# EAGLE schematic Node 1 (EAGLE 7.7.0)
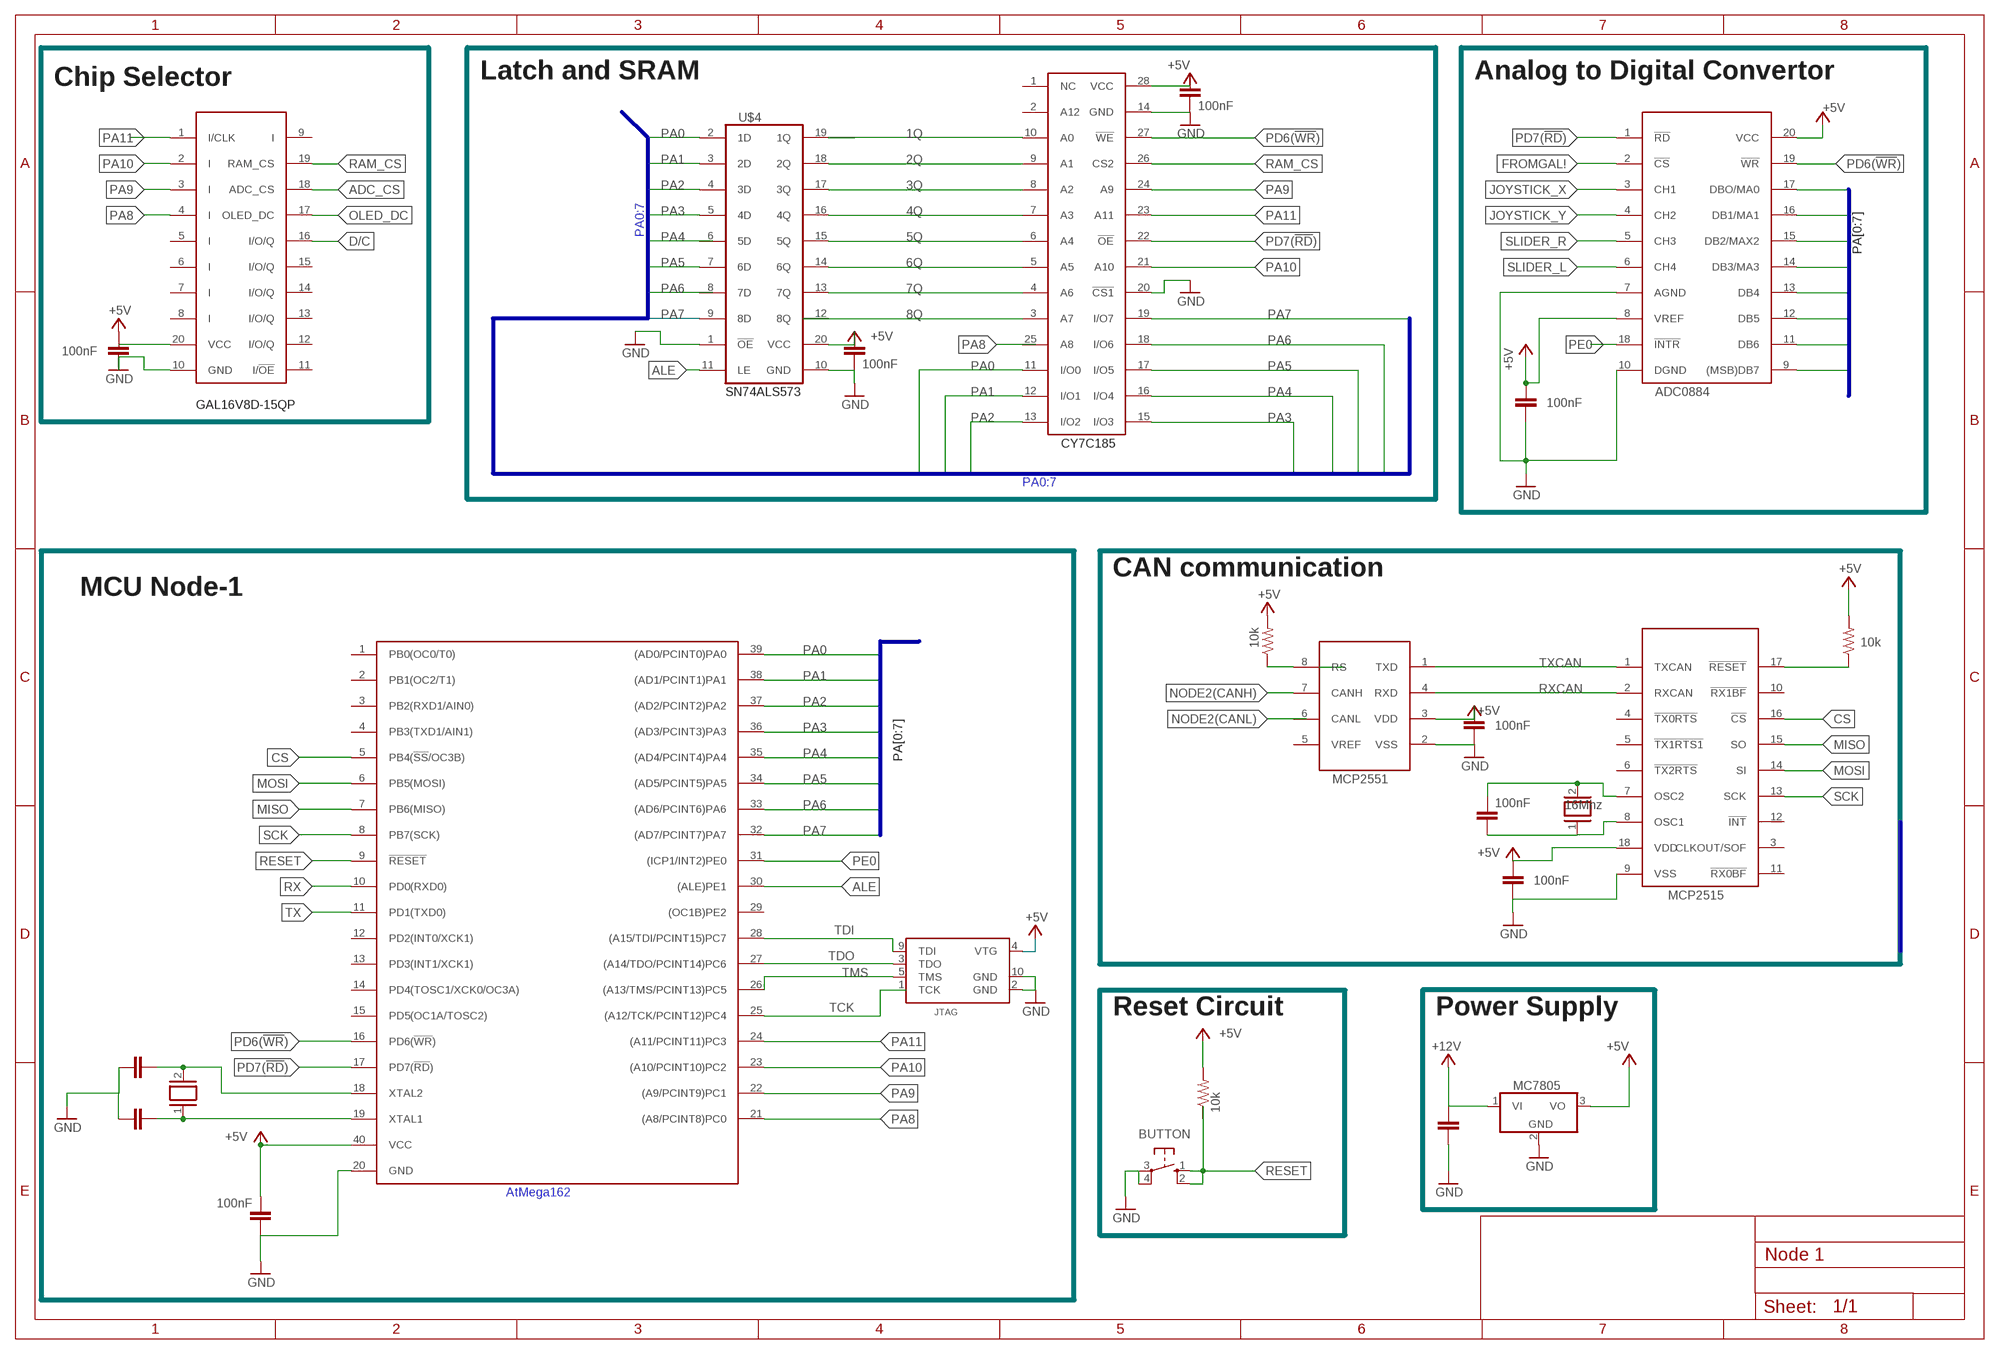
[diagram p0: schematic, sheet 1]

## Parts
ADC1  ADC0884  [DIP]
BUTTON  10-XX  [B3F-10XX]
C1  C-EU025-024X044  [C025-024X044]
C4  100nF  C-EU025-024X044  [C025-024X044]
C5  0  C-EUC1206  [C1206]
C6  0  C-EUC1206  [C1206]
C7  100nF  C-EU025-024X044  [C025-024X044]
C8  100nF  C-EU025-024X044  [C025-024X044]
C9  100nF  C-EU025-024X044  [C025-024X044]
C10  100nF  C-EU025-024X044  [C025-024X044]
C11  100nF  C-EU025-024X044  [C025-024X044]
C12  100nF  C-EU025-024X044  [C025-024X044]
C13  100nF  C-EU025-024X044  [C025-024X044]
Q1  4.9Mhz  XTAL/S  [QS]
Q2  16Mhz  XTAL/S  [QS]
R1  10k  R-US_0204/2V  [0204V]
R2  10k  R-US_0204/2V  [0204V]
R3  10k  R-US_0204/2V  [0204V]
U$1  ATMEGA162  [PDIP40]
U$2  MC7805  [MC7805]
U$3  JTAG  [DIP]
U$4  D-LATCH  [D-LATCH-20]
U$5  MCP2515  [MCP2515]
U$6  MCP2551  [MCP2551]
U$7  GAL  [DIP]
U$8  SRAM  [SRAM28]

## Nets
1Q: U$4.19(1Q) U$8.10(A0)
2Q: U$4.18(2Q) U$8.9(A1)
3Q: U$4.17(3Q) U$8.8(A2)
4Q: U$4.16(4Q) U$8.7(A3)
5Q: U$4.15(5Q) U$8.6(A4)
6Q: U$4.14(6Q) U$8.5(A5)
7Q: U$4.13(7Q) U$8.4(A6)
8Q: U$4.12(8Q) U$8.3(A7)
+5V: ADC1.8(VREF) ADC1.20(VCC) C1.1 C4.1 C7.1 C8.1 C9.1 C10.1 C11.1 R1.2 R2.2 R3.2 U$1.40(VCC) U$2.1(VI) U$2.3(VO) U$4.20(VCC) U$5.18(VDD) U$8.28(VCC) ; supply symbol labelled +12V
ADC_CS: U$7.18(ADC_CS)
ALE: U$1.30((ALE)PE1) U$4.11(LE)
CS: U$1.5(PB4(!SS!/OC3B)) U$5.16(!CS!)
D/C: U$7.16(I/O/Q)
FROMGAL!: ADC1.2(!CS!)
GND: ADC1.7(AGND) ADC1.10(DGND) BUTTON.3(P) BUTTON.4(P1) C1.2 C4.2 C5.1 C6.1 C7.2 C8.2 C9.2 C10.2 C11.2 C13.2 U$1.20(GND) U$2.2(GND) U$3.2(GND) U$3.10(GND) U$4.1(!OE!) U$4.10(GND) U$5.9(VSS) U$6.2(VSS) U$7.10(GND) U$8.14(GND) U$8.20(!CS1!)
JOYSTICK_X: ADC1.3(CH1)
JOYSTICK_Y: ADC1.4(CH2)
MISO: U$1.7(PB6(MISO)) U$5.15(SO)
MOSI: U$1.6(PB5(MOSI)) U$5.14(SI)
N$1: R3.1 U$5.17(!RESET!)
N$2: C5.2 Q1.2 U$1.18(XTAL2)
N$3: C6.2 Q1.1 U$1.19(XTAL1)
N$4: U$6.3(VDD)
N$6: C12.1 Q2.2 U$5.7(OSC2)
N$7: U$7.20(VCC)
N$8: C12.2 Q2.1 U$5.8(OSC1)
NODE2(CANH): U$6.7(CANH)
NODE2(CANL): U$6.6(CANL)
OLED_DC: U$7.17(OLED_DC)
PA0: ADC1.17(DBO/MA0) U$1.39((AD0/PCINT0)PA0) U$4.2(1D) U$8.11(I/O0)
PA1: ADC1.16(DB1/MA1) U$1.38((AD1/PCINT1)PA1) U$4.3(2D) U$8.12(I/O1)
PA2: ADC1.15(DB2/MAX2) U$1.37((AD2/PCINT2)PA2) U$4.4(3D) U$8.13(I/O2)
PA3: ADC1.14(DB3/MA3) U$1.36((AD3/PCINT3)PA3) U$4.5(4D) U$8.15(I/O3)
PA4: ADC1.13(DB4) U$1.35((AD4/PCINT4)PA4) U$4.6(5D) U$8.16(I/O4)
PA5: ADC1.12(DB5) U$1.34((AD5/PCINT5)PA5) U$4.7(6D) U$8.17(I/O5)
PA6: ADC1.11(DB6) U$1.33((AD6/PCINT6)PA6) U$4.8(7D) U$8.18(I/O6)
PA7: ADC1.9((MSB)DB7) U$1.32((AD7/PCINT7)PA7) U$8.19(I/O7)
PA8: U$1.21((A8/PCINT8)PC0) U$7.4(I) U$8.25(A8)
PA9: U$1.22((A9/PCINT9)PC1) U$7.3(I) U$8.24(A9)
PA10: U$1.23((A10/PCINT10)PC2) U$7.2(I) U$8.21(A10)
PA11: U$1.24((A11/PCINT11)PC3) U$7.1(I/CLK) U$8.23(A11)
PD6(!WR!): ADC1.19(!WR!) U$1.16(PD6(!WR!)) U$8.27(!WE!)
PD7(!RD!): ADC1.1(!RD!) U$1.17(PD7(!RD!)) U$8.22(!OE!)
PE0: ADC1.18(!INTR!) U$1.31((ICP1/INT2)PE0)
RAM_CS: U$7.19(RAM_CS) U$8.26(CS2)
RESET: BUTTON.1(S) BUTTON.2(S1) R1.1 U$1.9(!RESET!)
RESET1: R2.1 U$6.8(RS)
RX: U$1.10(PD0(RXD0))
RXCAN: U$5.2(RXCAN) U$6.4(RXD)
SCK: U$1.8(PB7(SCK)) U$5.13(SCK)
SLIDER_L: ADC1.6(CH4)
SLIDER_R: ADC1.5(CH3)
TCK: U$1.25((A12/TCK/PCINT12)PC4) U$3.1(TCK)
TDI: U$1.28((A15/TDI/PCINT15)PC7) U$3.9(TDI)
TDO: U$1.27((A14/TDO/PCINT14)PC6) U$3.3(TDO)
TMS: U$1.26((A13/TMS/PCINT13)PC5) U$3.5(TMS)
TX: U$1.11(PD1(TXD0))
TXCAN: U$5.1(TXCAN) U$6.1(TXD)
Unconnected: C13.1 U$1.1(PB0(OC0/T0)) U$1.2(PB1(OC2/T1)) U$1.3(PB2(RXD1/AIN0)) U$1.4(PB3(TXD1/AIN1)) U$1.12(PD2(INT0/XCK1)) U$1.13(PD3(INT1/XCK1)) U$1.14(PD4(TOSC1/XCK0/OC3A)) U$1.15(PD5(OC1A/TOSC2)) U$1.29((OC1B)PE2) U$3.4(VTG) U$4.9(8D) U$5.3(CLKOUT/SOF) U$5.4(!TX0RTS!) U$5.5(!TX1RTS1) U$5.6(!TX2RTS!) U$5.10(!RX1BF!) U$5.11(!RX0BF!) U$5.12(!INT!) U$6.5(VREF) U$7.5(I) U$7.6(I) U$7.7(I) U$7.8(I) U$7.9(I) U$7.11(I/!OE!) U$7.12(I/O/Q) U$7.13(I/O/Q) U$7.14(I/O/Q) U$7.15(I/O/Q) U$8.1(NC) U$8.2(A12)

## Buses
B$3
PA7
B$2

## Notes on the sheet
- Latch and SRAM | Analog to Digital Convertor
- Chip Selector
- PA0:7
- PA[0:7]
- SN74ALS573
- GAL16V8D-15QP
- CY7C185
- PA0:7
- MCU Node-1 | CAN communication
- PA[0:7]
- MCP2551
- 16Mhz
- MCP2515
- Reset Circuit | Power Supply
- AtMega162

## Library data of the parts
ADC1 = Byggern:ADC0884
BUTTON = switch-omron:10-XX: OMRON SWITCH; MPN: B3F-1000; OC_FARNELL: 176432; OC_NEWARK: 36M3542
C1 C4 C7-C13 = resistor:C-EU: CAPACITOR, European symbol
C5 C6 = rcl:C-EU: CAPACITOR, European symbol
Q1 Q2 = special:XTAL/S: CRYSTAL
R1-R3 = resistor:R-US_: RESISTOR, American symbol
U$1 = Byggern:ATMEGA162
U$2 = Byggern:MC7805
U$3 = Byggern:JTAG
U$4 = Byggern:D-LATCH
U$5 = Byggern:MCP2515
U$6 = Byggern:MCP2551
U$7 = Byggern:GAL
U$8 = Byggern:SRAM

## Net classes
0 default: width 0.3 mm, drill 0.6 mm, clearance 0.2 mm
1 power: width 0.4 mm, drill 0.6 mm, clearance 0.2 mm